# Altium schematic sheet POWER.SchDoc
size A4
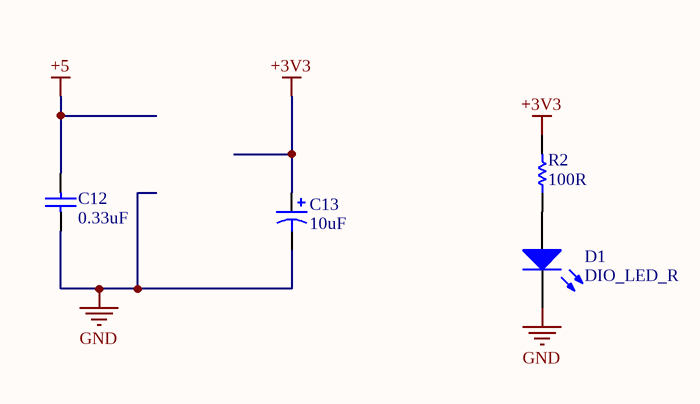
[diagram p0: POWER.SchDoc]

## Parts
C12  value 0.33uF  [CAPC0603(1608)55_N]  (hidden comment: CAP_0.1uF_16V_0603)
C13  value 10uF  [POLAR0.8]  (hidden comment: CAP_22uF_POL)
D1  DIO_LED_R  [LED_0805]
R2  value 100R  [RESC0201(0603)_N]  (hidden comment: RES_100R_0603)

## Nets
+3V3: C13.1 R2.2
+5: C12.2
GND: C12.1 C13.2 D1.2(K)
NetD1_1: D1.1(A) R2.1

## Library data of the parts
C12 = CAP_0.1uF_16V_0603: CAP CER 0.1UF 16V X7R 0603; Part Number: CC0603KRX7R7BB104; Manufacturer: Yageo; Dimensions: 0.063" L x 0.031" W (1.60mm x 0.80mm); Package: 0603 (1608 Metric); Temperature Coefficient: X7R; Voltage Rating: 16V
C13 = CAP_22uF_POL: CAP ALUM 22UF 20% 50V RADIAL; Manufacturer: Wurth Electronics Inc.; Part Number: 860020672011; Voltage Rating: 50V; Tolerance: 20%
D1 = DIO_LED_R: LED RED DIFFUSED 0805 SMD; Part Number: LS R976-NR-1; Manufacturer: OSRAM; Forward Voltage Drop: 2V; Package: 0805 (2012 Metric)
R2 = RES_100R_0603: RES SMD 100 OHM 1% 1/10W 0603; Manufacturer: Yageo; Part Number (MPN): RC0603FR-07100RL; Package: 0603 (1608 Metric); Dimensions: 0.063" L x 0.031" W (1.60mm x 0.80mm); Tolerance: 1%